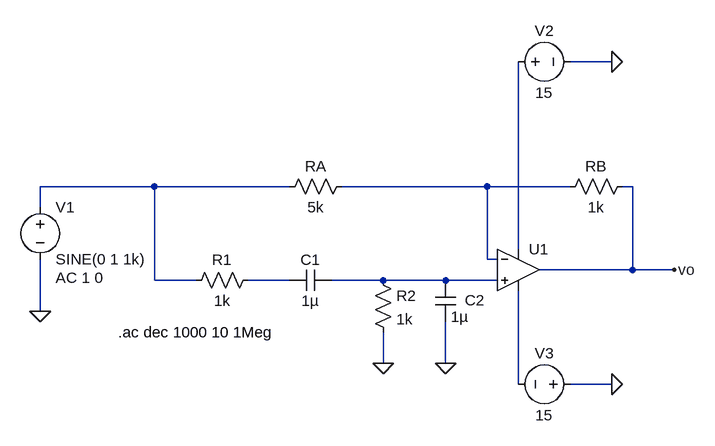
[diagram p0: schematic Ej4_b.asc]
Ej4_b.asc, the LTspice schematic file:
Version 4
SHEET 1 880 680
WIRE 368 -176 304 -176
WIRE -336 16 -512 16
WIRE -128 16 -336 16
WIRE 176 16 -48 16
WIRE 304 16 176 16
WIRE 400 16 384 16
WIRE -512 48 -512 16
WIRE 224 112 224 -176
WIRE 176 128 176 16
WIRE 192 128 176 128
WIRE 400 144 400 16
WIRE 400 144 256 144
WIRE 464 144 400 144
WIRE -336 160 -336 16
WIRE -272 160 -336 160
WIRE -128 160 -192 160
WIRE 16 160 -64 160
WIRE 112 160 16 160
WIRE 192 160 112 160
WIRE -512 208 -512 128
WIRE 16 288 16 240
WIRE 112 288 112 224
WIRE 224 320 224 176
WIRE 368 320 304 320
FLAG 16 288 0
FLAG 112 288 0
FLAG 464 144 vo
FLAG -512 208 0
FLAG 368 -176 0
FLAG 368 320 0
SYMBOL OpAmps\\UniversalOpAmp1 224 144 R0
SYMATTR InstName U1
SYMBOL res -32 0 R90
WINDOW 0 0 56 VBottom 2
WINDOW 3 32 56 VTop 2
SYMATTR InstName RA
SYMATTR Value 5k
SYMBOL res 400 0 R90
WINDOW 0 0 56 VBottom 2
WINDOW 3 32 56 VTop 2
SYMATTR InstName RB
SYMATTR Value 1k
SYMBOL res -176 144 R90
WINDOW 0 0 56 VBottom 2
WINDOW 3 32 56 VTop 2
SYMATTR InstName R1
SYMATTR Value 1k
SYMBOL res 0 144 R0
SYMATTR InstName R2
SYMATTR Value 1k
SYMBOL cap 96 160 R0
WINDOW 0 46 31 Left 2
SYMATTR InstName C2
SYMATTR Value 1µ
SYMBOL cap -64 144 R90
WINDOW 0 0 32 VBottom 2
WINDOW 3 32 32 VTop 2
SYMATTR InstName C1
SYMATTR Value 1µ
SYMBOL voltage -512 32 R0
WINDOW 123 24 124 Left 2
WINDOW 39 0 0 Left 0
SYMATTR InstName V1
SYMATTR Value SINE(0 1 1k)
SYMATTR Value2 AC 1 0
SYMBOL voltage 208 -176 R270
WINDOW 0 32 56 VTop 2
WINDOW 3 -32 56 VBottom 2
WINDOW 123 0 0 Left 0
WINDOW 39 0 0 Left 0
SYMATTR InstName V2
SYMATTR Value 15
SYMBOL voltage 320 320 R90
WINDOW 0 -32 56 VBottom 2
WINDOW 3 32 56 VTop 2
WINDOW 123 0 0 Left 0
WINDOW 39 0 0 Left 0
SYMATTR InstName V3
SYMATTR Value 15
TEXT -392 240 Left 2 !.ac dec 1000 10 1Meg

The netlist it stands for:
* Ej4_b.asc
XU1 N005 N002 N003 N006 vo level1 Avol=1Meg GBW=10Meg Vos=0 En=0 Enk=0 In=0 Ink=0 Rin=500Meg  ; pins In+ In- V+ V- OUT
RA N002 N001 5k
RB vo N002 1k
R1 N004 N001 1k
R2 N005 0 1k
C2 N005 0 1µ
C1 N005 N004 1µ
V1 N001 0 SINE(0 1 1k) AC 1 0
V2 N003 0 15
V3 0 N006 15
.ac dec 1000 10 1Meg
.lib UniversalOpAmp1.lib
.backanno
.end